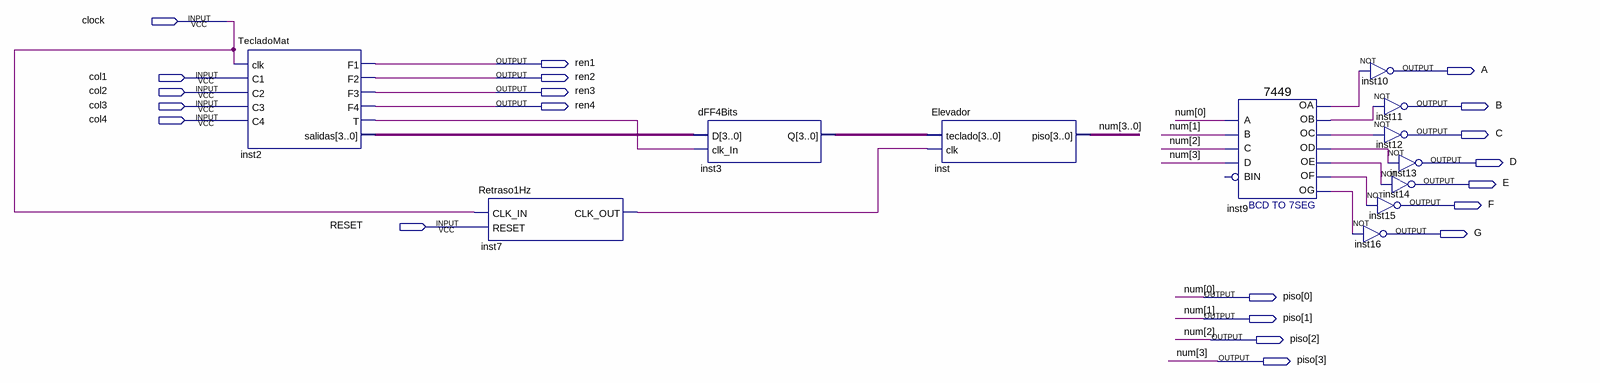
[diagram p0: schematic sheet]
// Quartus schematic ProyectoFinal.bdf as structural Verilog: 12 symbols, 21 pins
module ProyectoFinal (
  input  clock,
  input  col1,
  input  col2,
  input  col3,
  input  col4,
  input  RESET,
  output ren1,
  output A,
  output ren2,
  output ren3,
  output ren4,
  output B,
  output C,
  output D,
  output E,
  output F,
  output G,
  output [3:0] piso
);

  wire inst2_t, inst7_clk_out, inst9_oa, inst9_ob, inst9_oc, inst9_od, inst9_oe, inst9_of, inst9_og;
  wire [3:0] inst2_salidas, inst3_q;

  TecladoMat inst2 (
    .clk(clock), .C1(col1), .C2(col2), .C3(col3), .C4(col4), .F1(ren1), .F2(ren2), .F3(ren3), .F4(ren4),
    .T(inst2_t), .salidas(inst2_salidas));
  Retraso1Hz inst7 (.CLK_IN(clock), .RESET(RESET), .CLK_OUT(inst7_clk_out));
  dFF4Bits inst3 (.D(inst2_salidas), .clk_In(inst2_t), .Q(inst3_q));
  Elevador inst (.teclado(inst3_q), .clk(inst7_clk_out), .piso(piso));
  \7449  inst9 (
    .A(piso[0]), .C(piso[2]), .B(piso[1]), .D(piso[3]), .OC(inst9_oc), .OD(inst9_od), .OF(inst9_of),
    .OG(inst9_og), .OB(inst9_ob), .OA(inst9_oa), .OE(inst9_oe));  // open: BIN
  not inst10 (A, inst9_oa);
  not inst11 (B, inst9_ob);
  not inst12 (C, inst9_oc);
  not inst15 (F, inst9_of);
  not inst16 (G, inst9_og);
  not inst13 (D, inst9_od);
  not inst14 (E, inst9_oe);

  // Other names for the same wires on the sheet: num[3:0] = piso
endmodule
